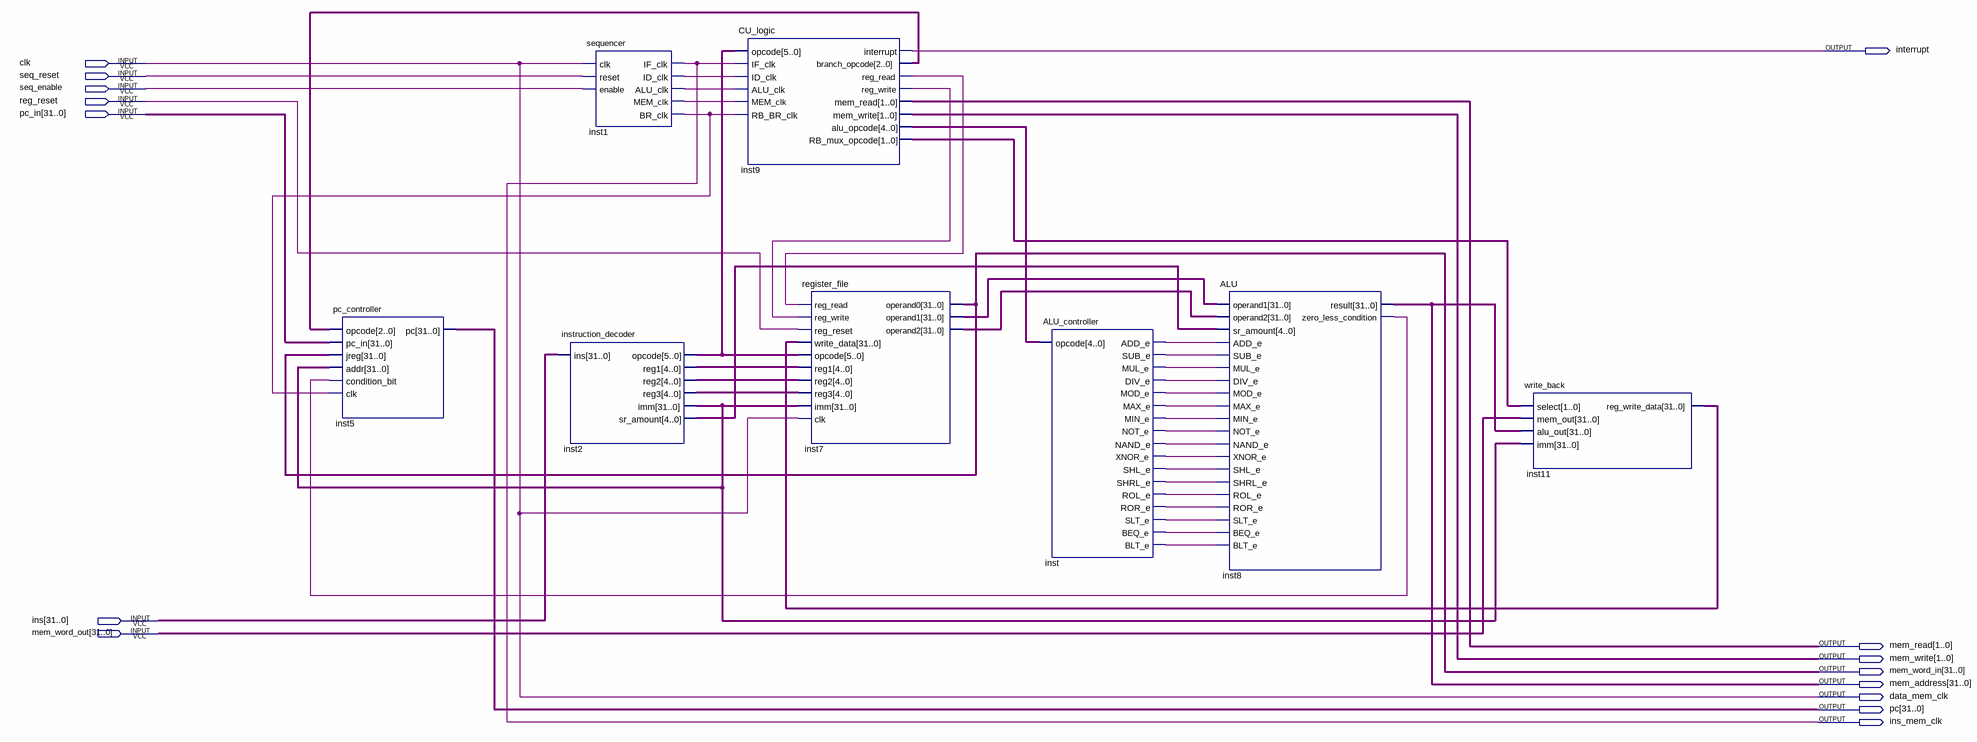
[diagram p0: schematic sheet]
// Quartus schematic CPU.bdf as structural Verilog: 8 symbols, 15 pins
module CPU (
  input  clk,
  input  seq_reset,
  input  seq_enable,
  input  reg_reset,
  input  [31:0] pc_in,
  input  [31:0] ins,
  input  [31:0] mem_word_out,
  output interrupt,
  output [1:0] mem_read,
  output [1:0] mem_write,
  output [31:0] mem_word_in,
  output [31:0] mem_address,
  output data_mem_clk,
  output [31:0] pc,
  output ins_mem_clk
);

  wire inst1_alu_clk, inst1_br_clk, inst1_id_clk, inst1_mem_clk, inst8_zero_less_condition, inst9_reg_read,
       inst9_reg_write, inst_add_e, inst_beq_e, inst_blt_e, inst_div_e, inst_max_e, inst_min_e, inst_mod_e,
       inst_mul_e, inst_nand_e, inst_not_e, inst_rol_e, inst_ror_e, inst_shl_e, inst_shrl_e, inst_slt_e,
       inst_sub_e, inst_xnor_e;
  wire [1:0] inst9_rb_mux_opcode;
  wire [2:0] inst9_branch_opcode;
  wire [4:0] inst2_reg1, inst2_reg2, inst2_reg3, inst2_sr_amount, inst9_alu_opcode;
  wire [5:0] inst2_opcode;
  wire [31:0] inst2_imm, inst7_operand1, inst7_operand2, inst11_reg_write_data;

  pc_controller inst5 (
    .opcode(inst9_branch_opcode), .pc_in(pc_in), .jreg(mem_word_in), .addr(inst2_imm),
    .condition_bit(inst8_zero_less_condition), .clk(inst1_br_clk), .pc(pc));
  instruction_decoder inst2 (
    .ins(ins), .opcode(inst2_opcode), .reg1(inst2_reg1), .reg2(inst2_reg2), .reg3(inst2_reg3),
    .imm(inst2_imm), .sr_amount(inst2_sr_amount));
  sequencer inst1 (
    .clk(clk), .reset(seq_reset), .enable(seq_enable), .IF_clk(ins_mem_clk), .ID_clk(inst1_id_clk),
    .ALU_clk(inst1_alu_clk), .MEM_clk(inst1_mem_clk), .BR_clk(inst1_br_clk));
  CU_logic inst9 (
    .opcode(inst2_opcode), .IF_clk(ins_mem_clk), .ID_clk(inst1_id_clk), .ALU_clk(inst1_alu_clk),
    .MEM_clk(inst1_mem_clk), .RB_BR_clk(inst1_br_clk), .interrupt(interrupt),
    .branch_opcode(inst9_branch_opcode), .reg_read(inst9_reg_read), .reg_write(inst9_reg_write),
    .mem_read(mem_read), .mem_write(mem_write), .alu_opcode(inst9_alu_opcode),
    .RB_mux_opcode(inst9_rb_mux_opcode));
  register_file inst7 (
    .reg_read(inst9_reg_read), .reg_write(inst9_reg_write), .reg_reset(reg_reset),
    .write_data(inst11_reg_write_data), .opcode(inst2_opcode), .reg1(inst2_reg1), .reg2(inst2_reg2),
    .reg3(inst2_reg3), .imm(inst2_imm), .clk(clk), .operand0(mem_word_in), .operand1(inst7_operand1),
    .operand2(inst7_operand2));
  ALU_controller inst (
    .opcode(inst9_alu_opcode), .ADD_e(inst_add_e), .SUB_e(inst_sub_e), .MUL_e(inst_mul_e),
    .DIV_e(inst_div_e), .MOD_e(inst_mod_e), .MAX_e(inst_max_e), .MIN_e(inst_min_e), .NOT_e(inst_not_e),
    .NAND_e(inst_nand_e), .XNOR_e(inst_xnor_e), .SHL_e(inst_shl_e), .SHRL_e(inst_shrl_e), .ROL_e(inst_rol_e),
    .ROR_e(inst_ror_e), .SLT_e(inst_slt_e), .BEQ_e(inst_beq_e), .BLT_e(inst_blt_e));
  ALU inst8 (
    .operand1(inst7_operand1), .operand2(inst7_operand2), .sr_amount(inst2_sr_amount), .ADD_e(inst_add_e),
    .SUB_e(inst_sub_e), .MUL_e(inst_mul_e), .DIV_e(inst_div_e), .MOD_e(inst_mod_e), .MAX_e(inst_max_e),
    .MIN_e(inst_min_e), .NOT_e(inst_not_e), .NAND_e(inst_nand_e), .XNOR_e(inst_xnor_e), .SHL_e(inst_shl_e),
    .SHRL_e(inst_shrl_e), .ROL_e(inst_rol_e), .ROR_e(inst_ror_e), .SLT_e(inst_slt_e), .BEQ_e(inst_beq_e),
    .BLT_e(inst_blt_e), .result(mem_address), .zero_less_condition(inst8_zero_less_condition));
  write_back inst11 (
    .select(inst9_rb_mux_opcode), .mem_out(mem_word_out), .alu_out(mem_address), .imm(inst2_imm),
    .reg_write_data(inst11_reg_write_data));

  assign data_mem_clk = clk;
endmodule
